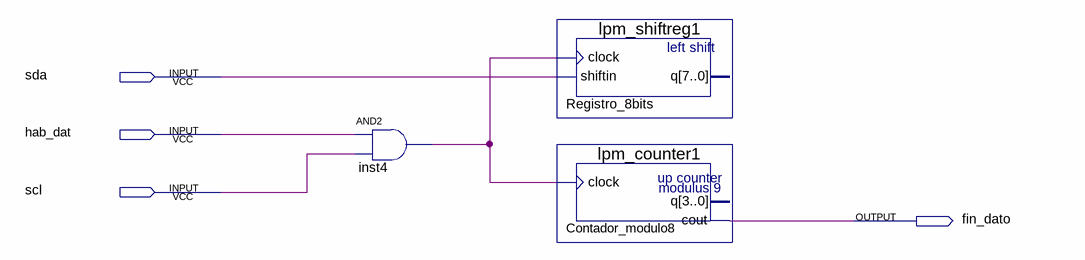
[diagram p0: schematic sheet]
// Quartus schematic Segundo_bloque.bdf as structural Verilog: 3 symbols, 4 pins
module Segundo_bloque (
  input  sda,
  input  hab_dat,
  input  scl,
  output fin_dato
);

  wire inst4_out;

  and inst4 (inst4_out, hab_dat, scl);
  lpm_shiftreg1 Registro_8bits (.clock(inst4_out), .shiftin(sda));  // open: q
  lpm_counter1 Contador_modulo8 (.clock(inst4_out), .cout(fin_dato));  // open: q
endmodule
